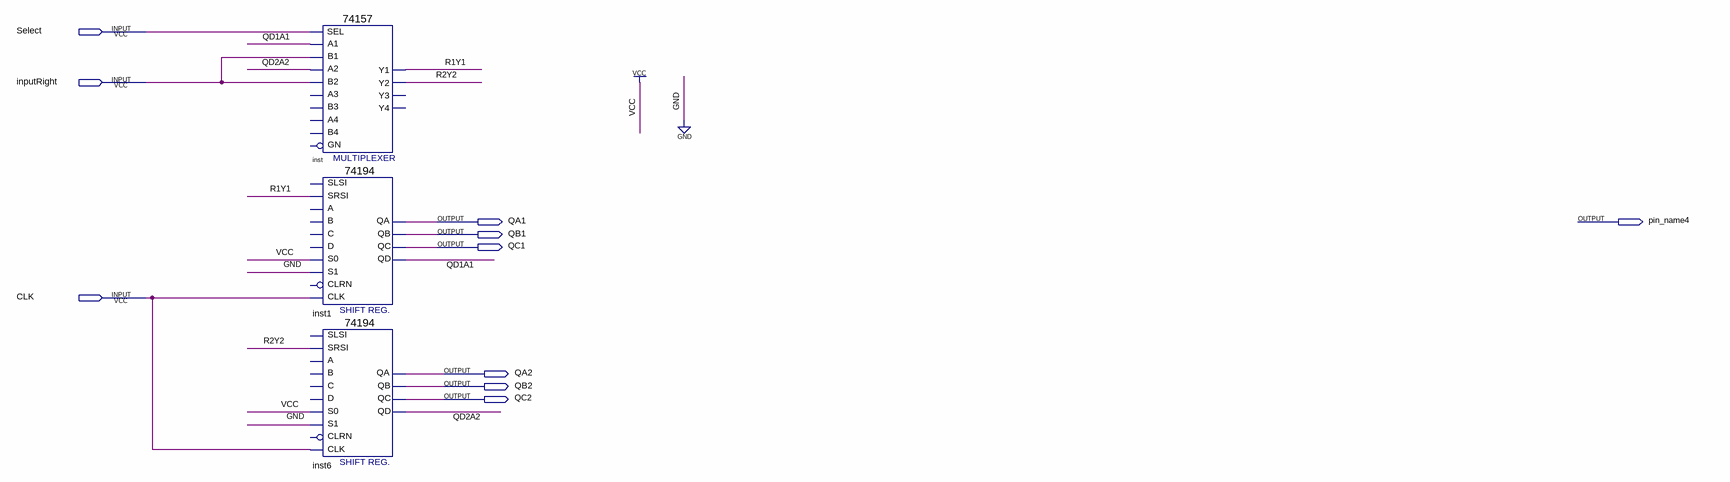
[diagram p0: schematic sheet]
// Quartus schematic Block1.bdf as structural Verilog: 3 symbols, 10 pins
module Block1 (
  input  Select,
  input  inputRight,
  input  CLK,
  output QA1,
  output pin_name4,
  output QB1,
  output QC1,
  output QA2,
  output QB2,
  output QC2
);

  wire QD1A1, QD2A2, R1Y1, R2Y2;

  \74157  inst (
    .A1(QD1A1), .B1(inputRight), .SEL(Select), .B2(inputRight), .A2(QD2A2), .Y2(R2Y2), .Y1(R1Y1));  // open: A3, B3, B4, GN, A4, Y4, Y3
  \74194  inst1 (
    .SRSI(R1Y1), .CLK(CLK), .S1(1'b0), .S0(1'b1), .QA(QA1), .QB(QB1), .QC(QC1), .QD(QD1A1));  // open: SLSI, B, C, CLRN, D, A
  \74194  inst6 (
    .SRSI(R2Y2), .CLK(CLK), .S1(1'b0), .S0(1'b1), .QA(QA2), .QB(QB2), .QC(QC2), .QD(QD2A2));  // open: SLSI, B, C, CLRN, D, A
endmodule
